# EAGLE schematic CompleteBoard (EAGLE 9.6.2)
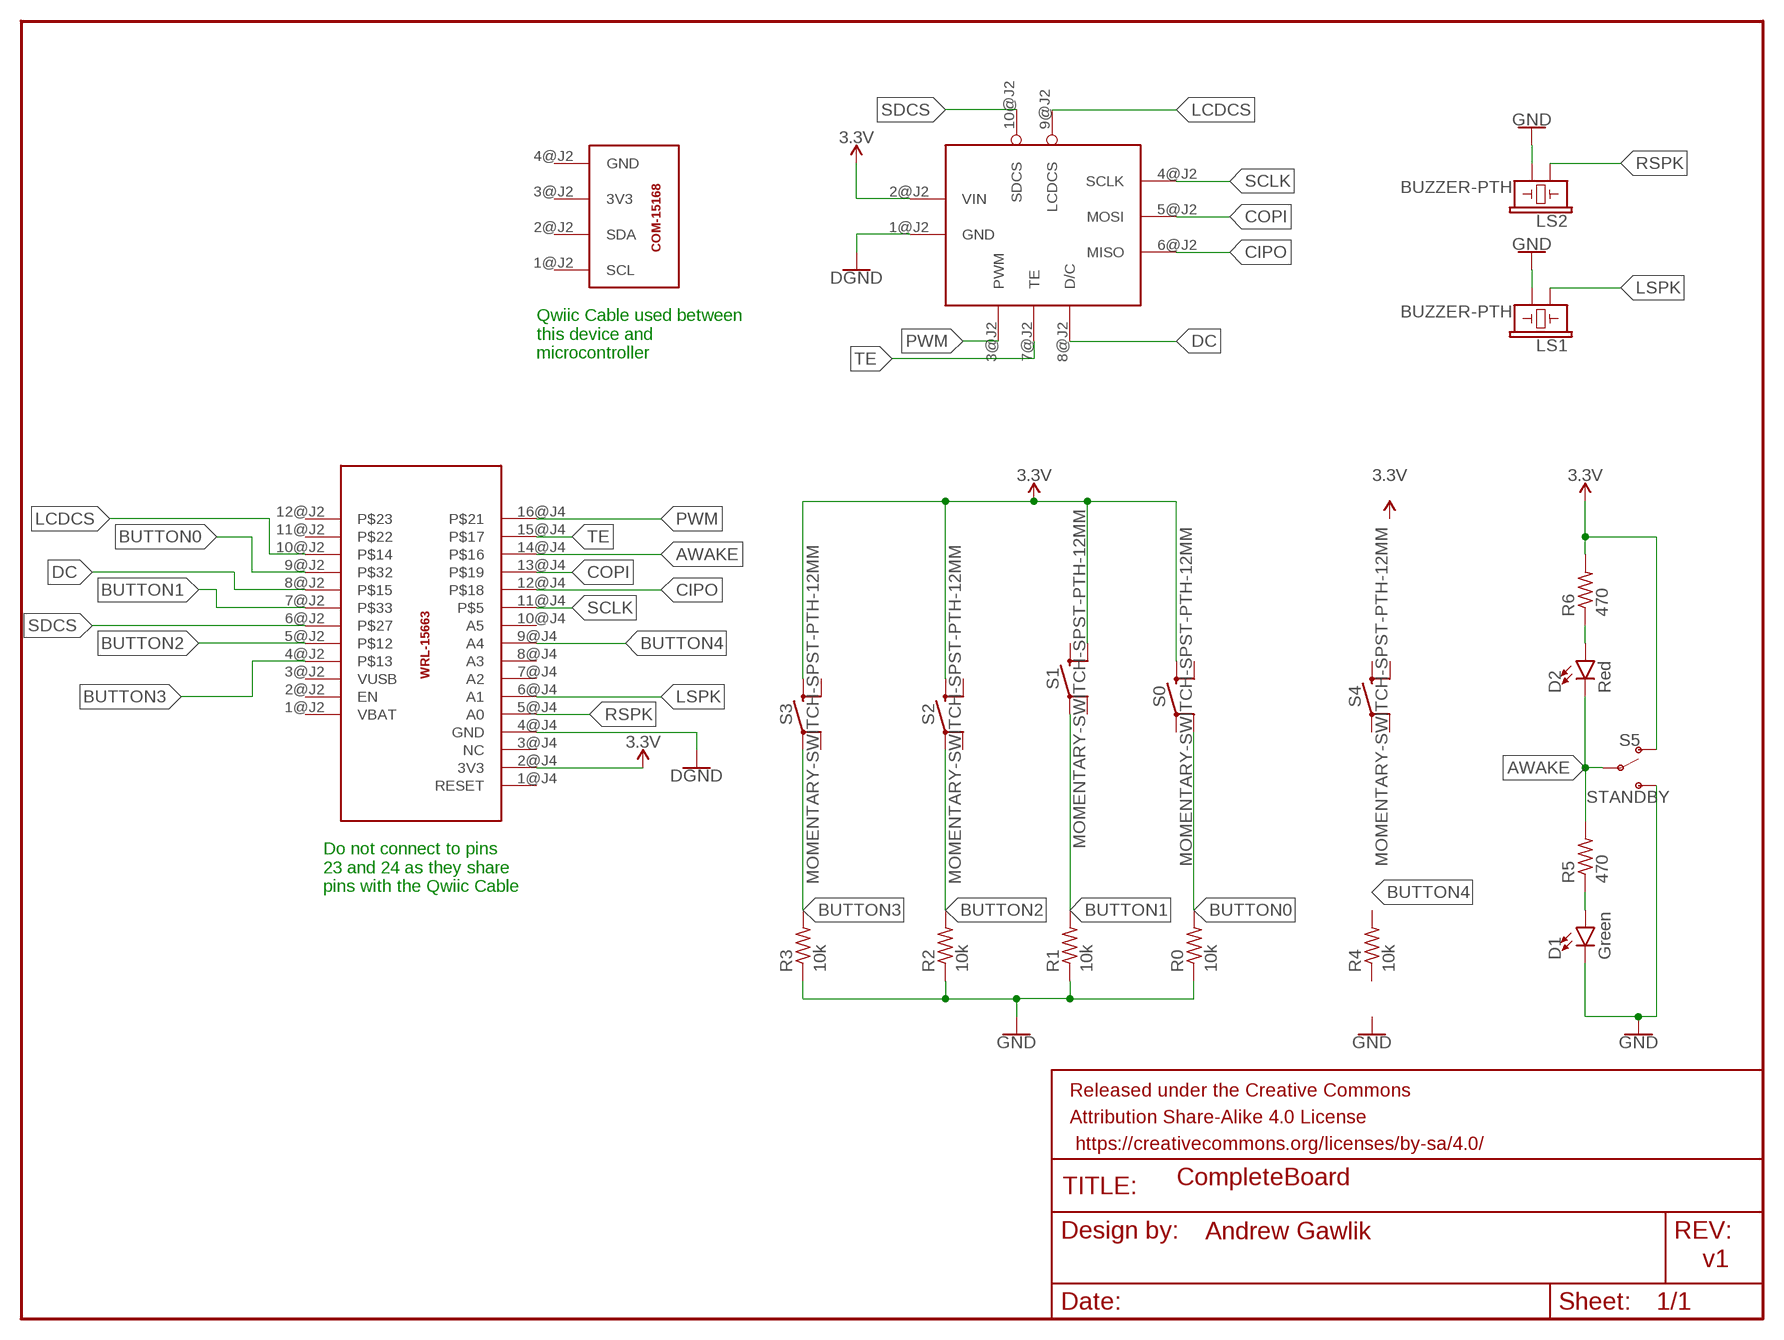
[diagram p0: schematic, sheet 1]

## Parts
A1  ESP32_MICROCONTROLLER  WRL-17381  [WRL-17381]
A2  TFT  LCD-15143  [LCD-15143]
A3  COM-15168  [COM-15168]
D1  Green  LED5MM-KIT  [LED_5MM-KIT]
D2  Red  LED5MM-KIT  [LED_5MM-KIT]
FRAME1  001  FRAME-LETTER  [CREATIVE_COMMONS]
LS1  BUZZER-PTH  [BUZZER-12MM]
LS2  BUZZER-PTH  [BUZZER-12MM]
R0  10k  R-US_0204/5  [0204/5]
R1  10k  R-US_0204/5  [0204/5]
R2  10k  R-US_0204/5  [0204/5]
R3  10k  R-US_0204/5  [0204/5]
R4  10k  R-US_0204/5  [0204/5]
R5  470  R-US_0204/5  [0204/5]
R6  470  R-US_0204/5  [0204/5]
S0  MOMENTARY-SWITCH-SPST-PTH-12MM  [TACTILE_SWITCH_PTH_12MM]
S1  MOMENTARY-SWITCH-SPST-PTH-12MM  [TACTILE_SWITCH_PTH_12MM]
S2  MOMENTARY-SWITCH-SPST-PTH-12MM  [TACTILE_SWITCH_PTH_12MM]
S3  MOMENTARY-SWITCH-SPST-PTH-12MM  [TACTILE_SWITCH_PTH_12MM]
S4  MOMENTARY-SWITCH-SPST-PTH-12MM  [TACTILE_SWITCH_PTH_12MM]
S5  STANDBY  SWITCH-SPDT-PTH-11.6X4.0MM  [SWITCH_SPDT_PTH_11.6X4.0MM]

## Nets
3.3V: A1.2@J4(3V3) A2.2@J2(VIN) R6.2 S0.3 S1.4 S2.3 S3.3 S5.1(O)
AWAKE: A1.14@J4 D2.K(C) R5.2 S5.2(P)
BUTTON0: A1.9@J2 R0.2 S0.2
BUTTON1: A1.7@J2 R1.2 S1.1
BUTTON2: A1.5@J2 R2.2 S2.1
BUTTON3: A1.4@J2 R3.2 S3.1
BUTTON4: A1.9@J4(A4)
CIPO: A1.12@J4 A2.6@J2(MISO)
COPI: A1.13@J4 A2.5@J2(MOSI)
DC: A1.8@J2 A2.8@J2(D/C)
GND: A1.4@J4(GND) A2.1@J2(GND) D1.K(C) LS1.- LS2.- R0.1 R1.1 R2.1 R3.1 S5.3(S) ; supply symbol labelled DGND
LCDCS: A1.10@J2 A2.9@J2(LCDCS)
LSPK: A1.6@J4(A1) LS1.+
N$2: D1.A R5.1
N$4: D2.A R6.1
PWM: A1.16@J4 A2.3@J2(PWM)
RSPK: A1.5@J4(A0) LS2.+
SCLK: A1.11@J4 A2.4@J2(SCLK)
SDCS: A1.6@J2 A2.10@J2(SDCS)
TE: A1.15@J4 A2.7@J2(TE)
Unconnected: A1.1@J2(VBAT) A1.1@J4(RESET) A1.2@J2(EN) A1.3@J2(VUSB) A1.3@J4(NC) A1.7@J4(A2) A1.8@J4(A3) A1.10@J4(A5) A1.11@J2 A1.12@J2 A3.1@J2(SCL) A3.2@J2(SDA) A3.3@J2(3V3) A3.4@J2(GND) R4.1 R4.2 S0.1 S0.4 S1.2 S1.3 S2.2 S2.4 S3.2 S3.4 S4.1 S4.2 S4.3 S4.4

## Notes on the sheet
- Qwiic Cable used between
  this device and
  microcontroller
- Do not connect to pins
  23 and 24 as they share
  pins with the Qwiic Cable
- Andrew Gawlik
- v1

## Library data of the parts
A1 = SparkFunBreakouts:WRL-17381: SparkFun Thing Plus - ESP32 WROOM (U.FL) The SparkFun ESP32 Thing Plus with U.FL is the next step to get started with Espressif IoT ideations while still enjoying all the amenities of the original ESP32 Thing. Espressif's ESP32 WROOM is a powerful WiFi and Bluetooth MCU module that targets a wide variety of applications. At the core of this module is the ESP32-D0WDQ6 chip which is designed to be both scalable and adaptive. To make the Thing Plus even easier to use, we've moved a few pins around to make the board Feather compatible and it utilizes our handy Qwiic Connect System which means no soldering or shields are required to connect it to the rest of your system! Why the name? We lovingly call it the “Thing” because it's the perfect foundation for your Internet of Things project. The Thing does everything from turning on an LED to posting data with your chosen platform, and can be programmed just like any microcontroller. You can even program the Thing through the Arduino IDE by installing the updated ESP32 Arduino Core <https://learn.sparkfun.com/tutorials/esp32-thing-plus-hookup-guide?_ga=2.27845048.500067859.1617115070-1450422450.1611246352#software-setup>. The ESP32 Thing plus integrates a rich set of peripherals, ranging from capacitive touch sensors, Hall sensors, SD card interface, Ethernet, high-speed SPI, UART, I2S and I2C. Thanks to the onboard ESP32 WROOM module, the SparkFun Thing Plus features 16MB of flash memory, 520kB of internal SRAM, an integrated 802.11 BGN WiFi transceiver and dual-mode Bluetooth capabilities, a JST connector to plug in a LiPo battery, and a U.FL connector for your own antenna. The SparkFun Qwiic Connect System is an ecosystem of I2C sensors, actuators, shields and cables that make prototyping faster and less prone to error. All Qwiic-enabled boards use a common 1mm pitch, 4-pin JST connector. This reduces the amount of required PCB space, and polarized connections mean you can’t hook it up wrong.
A2 = SparkFunBreakouts:LCD-15143: SparkFun TFT LCD Breakout - 1.8" (128x160) The SparkFun TFT LCD Breakout is a versatile, colorful, and easy way to experiment with graphics or create a user interface for your project. With a 4-wire SPI interface and microSD card holder, you can use this breakout to easily add visual display/interface capabilities to a project as well as providing all the storage you might need for multimedia files. To get started with this breakout, you will need an Arduino compatible microcontroller of your choice - we recommend something with extra RAM like the SparkFun Thing Plus <https://www.sparkfun.com/products/14689>. The breakout can be powered with either 5V or 3.3V. The microSD card holder is connected to the same SPI bus as the display which keeps the required pin count low and exists to relieve the burden from your microcontroller's poor memory due to having to store hundreds of images of cats, or really whatever you want to keep there. We have also gone ahead and tricked out the SparkFun HyperDisplay library <https://learn.sparkfun.com/tutorials/everything-you-should-know-about-hyperdisplay?_ga=2.57664686.500067859.1617115070-1450422450.1611246352> with a driver made especially for this breakout! Out of the box, the SparkFun TFT LCD Breakout will come with a large backing PCB that makes it easy to securely mount the display in a project. If you need a more flexible solution you can remove the display module, snap off half the backing board, and then re-insert the display module. When this is done you'll be left with the bare minimum frame around the display to more seamlessly integrate with your project.
A3 = SparkFunBreakouts:COM-15168: SparkFun Qwiic Joystick Now, you can easily add an HID/controller to your project! The SparkFun Qwiic Joystick combines the convenience of the Qwiic connection system and an analog joystick that feels reminiscent of the thumbstick from a PlayStation 2 controller and for that reason it's become a favorite of ours. The only thing that could make it better is a "smart" version, so we made one! With the pre-installed firmware, the ATtiny85 is acts as an intermediary (microcontroller) for the analog and digital inputs from the joystick. This allows the Qwiic Joystick to report its position over I2C. Utilizing our handy Qwiic system, no soldering is required to connect it to the rest of your system. However, we still have broken out 0.1"-spaced pins in case you prefer to use a breadboard. The joystick is similar to the analog joysticks on PS2 (PlayStation 2) controllers. Directional movements are simply measured with two 10 kΩ potentiometers, connected with a gimbal mechanism that separates the horizontal and vertical movements. This joystick also has a select button that is actuated when the joystick is pressed down. The SparkFun Qwiic Joystick's I2C address is also software selectable so you can plenty of them to the same bus without any risk of collision! NOTE: The I2C address of the Qwiic Joystick is 0x20 and is software configurable. A multiplexer/Mux is required to communicate to multiple Qwiic Joystick sensors on a single bus. If you need to use more than one Qwiic Joystick sensor consider using the Qwiic Mux Breakout <https://www.sparkfun.com/products/16784>. The SparkFun Qwiic Connect System is an ecosystem of I2C sensors, actuators, shields and cables that make prototyping faster and less prone to error. All Qwiic-enabled boards use a common 1mm pitch, 4-pin JST connector. This reduces the amount of required PCB space, and polarized connections mean you can’t hook it up wrong.
D1 D2 = SparkFun-LED:LED: LED (Generic) Standard schematic elements and footprints for 5mm, 3mm, 1206, and 0603 sized LEDs. Generic LEDs with no color specified.
FRAME1 = SparkFun-Aesthetics:FRAME-LETTER: Schematic Frame - Letter Standard 8.5x11 US Letter frame
LS1 LS2 = SparkFun-Electromechanical:BUZZER: Buzzer Small round buzzers that operate around the audible 2kHz range. You can use these as speakers to create simple music or user interfaces. Variant Overview: PTH - Mini Speaker - PC Mount 12mm 2.048kHz <https://www.sparkfun.com/products/7950> PTH_KIT - Mini Speaker - PC Mount 12mm 2.048kHz <https://www.sparkfun.com/products/7950> KIT simplifies soldering by adding stop mask to one side of the pads. PTH_NO_SILK - Mini Speaker - PC Mount 12mm 2.048kHz <https://www.sparkfun.com/products/7950> No silkscreen indicator of buzzer outline. PTH_KIT_NO_SILK - Mini Speaker - PC Mount 12mm 2.048kHz <https://www.sparkfun.com/products/7950> KIT package w/o silkscreen SMD - Buzzer Audio Magnetic (CCV-084B16) SMD buzzer used on, e.g. the LilyPad Buzzer <https://www.sparkfun.com/products/8463> and RFID USB Reader <https://www.sparkfun.com/products/9963>. SMD_KIT - Buzzer Audio Magnetic (CCV-084B16) SMD Buzzer with elongated pins to make soldering easier. Used on the SparkFun Simon Says - Surface Mount Soldering Kit <https://www.sparkfun.com/products/10935>.; PROD_ID: COMP-08253; SF_SKU: COM-07950
R0 R1-R6 = rcl:R-US_: RESISTOR, American symbol; SPICEPREFIX: R
S0 S1-S4 = SparkFun-Switches:MOMENTARY-SWITCH-SPST: Momentary Switch (Pushbutton) - SPST Normally-open (NO) SPST momentary switches (buttons, pushbuttons). Variants PTH-12MM - 12mm square, through-hole Momentary Pushbutton Switch - 12mm Square <https://www.sparkfun.com/products/9190> (COM-09190) PTH-6.0MM, PTH-6.0MM-KIT - 6.0mm square, through-hole Mini Pushbutton Switch <https://www.sparkfun.com/products/97> (COM-00097) KIT package intended for soldering kit's - only one side of pads' copper is exposed. PTH-RIGHT-ANGLE-KIT - Right-angle, through-hole Right Angle Tactile Button <https://www.sparkfun.com/products/10791> - Used on SparkFun BigTime Watch Kit <https://www.sparkfun.com/products/11734> SMD-12MM - 12mm square, surface-mount Tactile Button - SMD (12mm) <https://www.sparkfun.com/products/12993> (COM-12993) Used on SparkFun PicoBoard <https://www.sparkfun.com/products/11888> SMD-4.5MM - 4.5mm Square Trackball Switch Used on SparkFun Blackberry Trackballer Breakout <https://www.sparkfun.com/products/13169> SMD-4.6MMX2.8MM - 4.60mm x 2.80mm, surface mount Used on SparkFun SAMD21 Mini Breakout <https://www.sparkfun.com/products/13664> SMD-5.2MM, SMD-5.2-REDUNDANT - 5.2mm square, surface-mount Mini Pushbutton Switch - SMD <https://www.sparkfun.com/products/8720> (COM-08720) Used on Arduino Pro Mini <https://www.sparkfun.com/products/11114> REDUNDANT package connects both switch circuits together SMD-6.0X3.5MM - 6.0 x 3.5mm, surface mount Momentary Reset Switch SMD <https://www.sparkfun.com/products/8229> (COM-08229) SMD-6.2MM-TALL - 6.2mm square, surface mount Tactile Button - SMD (6mm) <https://www.sparkfun.com/products/12992> Used on SparkFun Digital Sandbox <https://www.sparkfun.com/products/12651> SMD-RIGHT-ANGLE - Right-angle, surface mount Used on SparkFun Block for Intel® Edison - Arduino <https://www.sparkfun.com/products/13036>; PROD_ID: SWCH-09185; SF_SKU: COM-09190
S5 = SparkFun-Switches:SWITCH-SPDT: Single Pole, Double Throw (SPDT) Switch Single-pole, double-throw (SPDT) switch. Variant Overview SMD-AYZ0202 Surface Mount DPDT Switch <https://www.sparkfun.com/products/597> (COM-00597) Used on e.g. LilyPad Arduino USB - ATmega32U4 Board <https://www.sparkfun.com/products/12049> PTH-11.6X4.0MM SPDT Mini Power Switch <https://www.sparkfun.com/products/102> (COM-00102) Used on e.g. SparkFun Simon Says - Through-Hole Soldering Kit <https://www.sparkfun.com/products/10547> (KIT-10547) PTH-11.6X4.0MM-KIT KIT version of SPDT Mini Power Switch - Simplifies soldering by removing tStop of switch pins - only one side can be soldered. PTH-11.6X4.0MM-LOCK LOCK version of SPDT Mini Power Switch - Offset pins hold switch in place for easier soldering. SMD-RIGHT-ANGLE Surface Mount Right Angle Switch <https://www.sparkfun.com/products/10860> (COM-10860) Used on e.g. SparkFun ESP8266 Thing <https://www.sparkfun.com/products/13231>; PROD_ID: SWCH-08261; SF_SKU: COM-00102